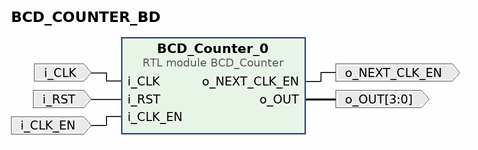
[diagram p0: block diagram of the top level]
# Vivado block design BCD_COUNTER_BD, xc7z007sclg400-1, Vivado 2018.3
create_bd_design BCD_COUNTER_BD

create_bd_port -dir I -type clk i_CLK
create_bd_port -dir I -type rst i_RST
set_property -dict {CONFIG.POLARITY ACTIVE_LOW} [get_bd_ports i_RST]
create_bd_port -dir I i_CLK_EN
create_bd_port -dir O o_NEXT_CLK_EN
create_bd_port -dir O -from 3 -to 0 o_OUT

create_bd_cell -type module -reference BCD_Counter BCD_Counter_0

# ---- connections ----

connect_bd_net -net i_CLK_0_1 [get_bd_ports i_CLK] [get_bd_pins BCD_Counter_0/i_CLK]
connect_bd_net -net i_RST_0_1 [get_bd_ports i_RST] [get_bd_pins BCD_Counter_0/i_RST]
connect_bd_net -net i_CLK_EN_0_1 [get_bd_ports i_CLK_EN] [get_bd_pins BCD_Counter_0/i_CLK_EN]
connect_bd_net [get_bd_pins BCD_Counter_0/o_NEXT_CLK_EN] [get_bd_ports o_NEXT_CLK_EN]
connect_bd_net [get_bd_pins BCD_Counter_0/o_OUT] [get_bd_ports o_OUT]

validate_bd_design
save_bd_design
